# EAGLE board RedundantSensors (EAGLE 9.6.2), part 1 of 2
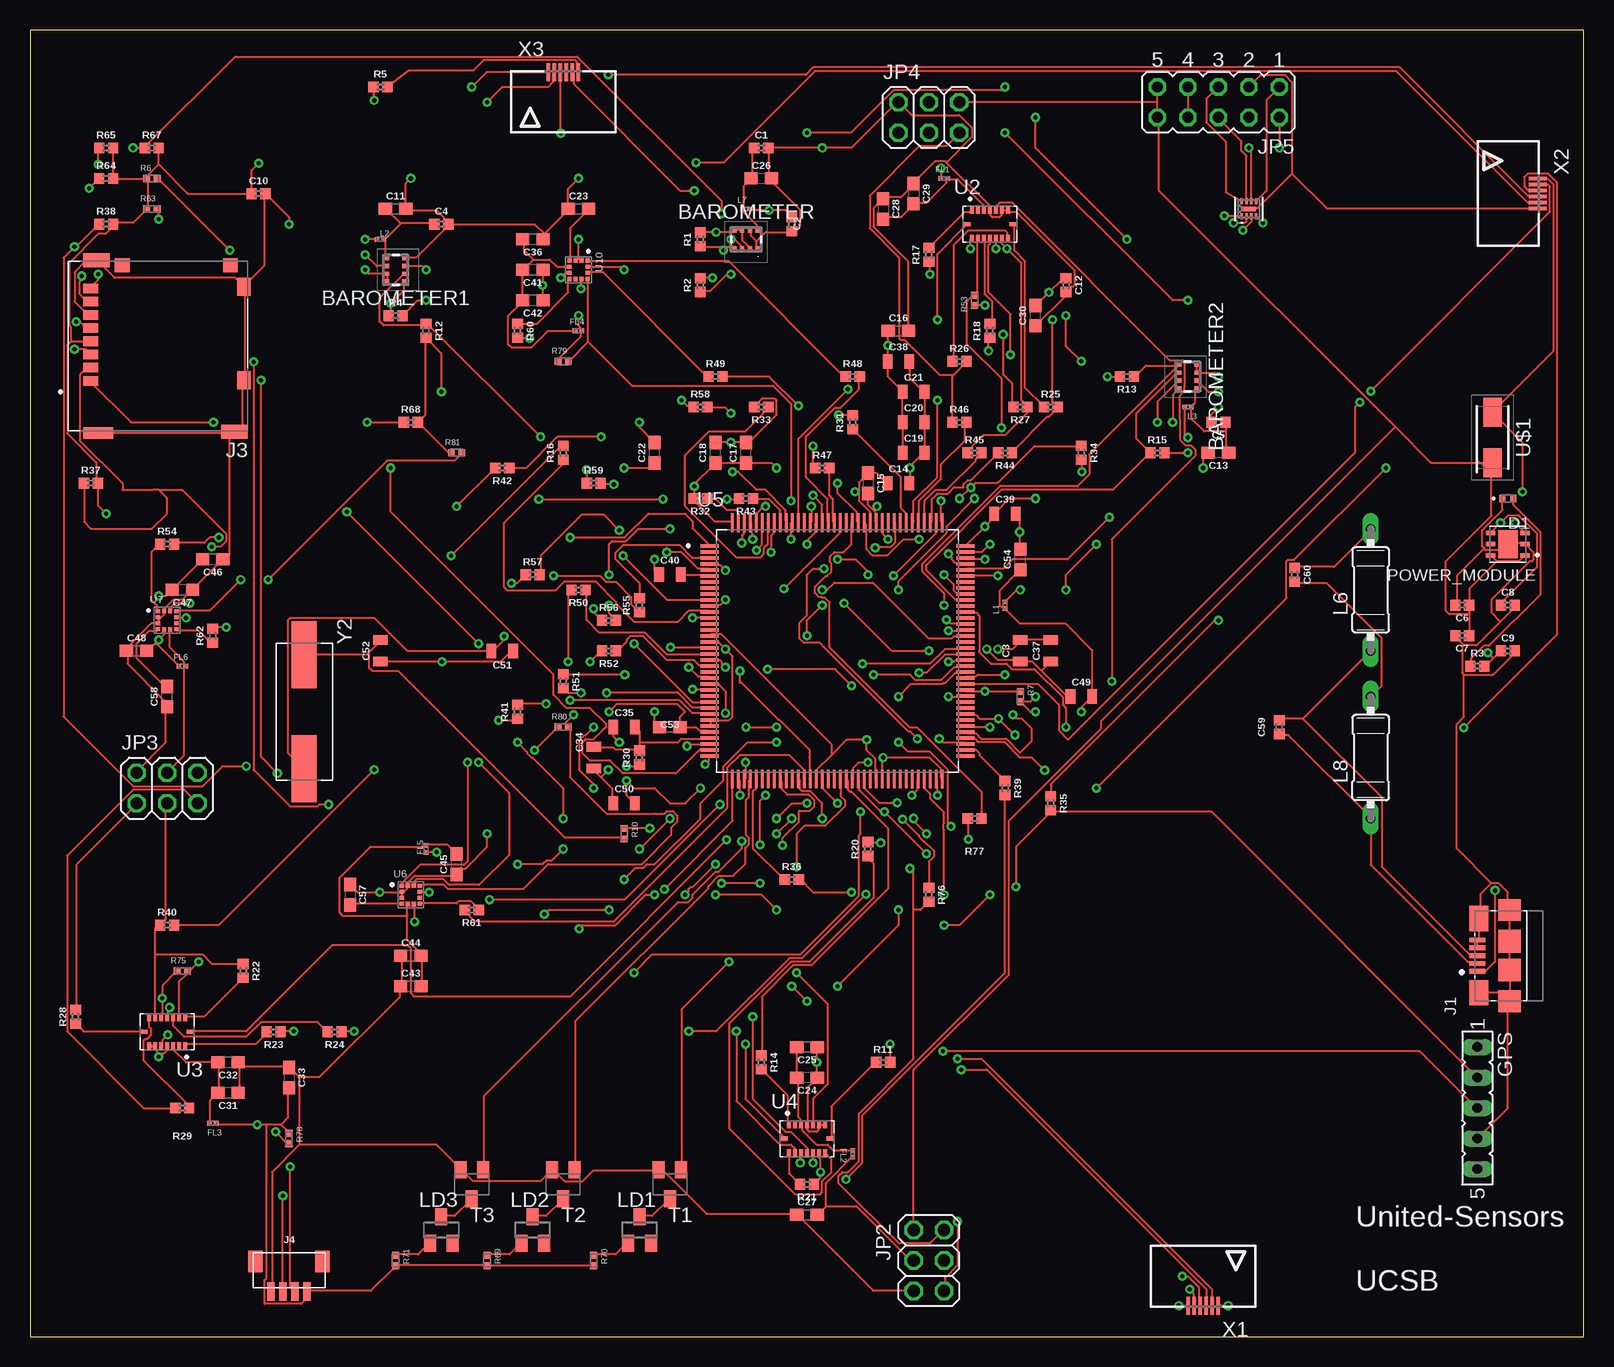
[diagram p2: board, top side]
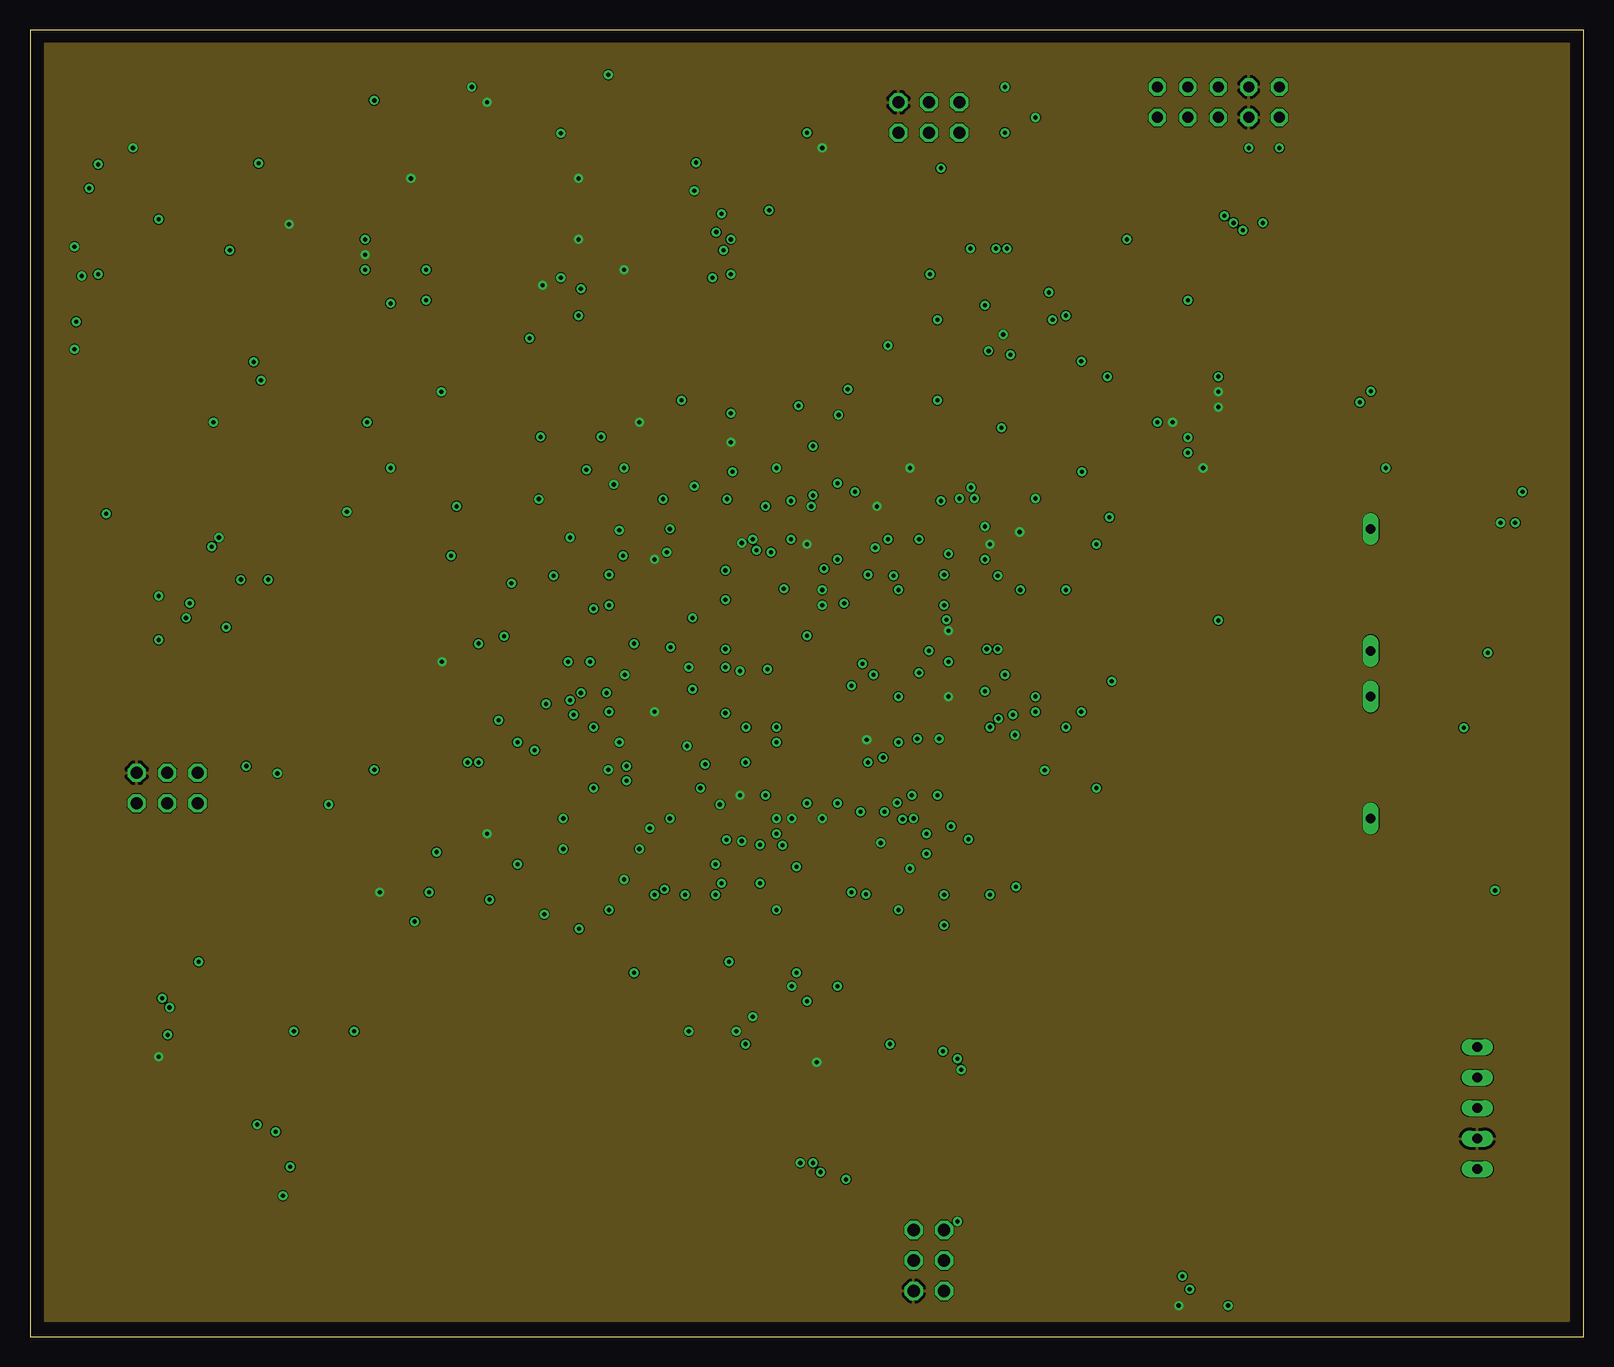
[diagram p3: board, inner layer Route2]
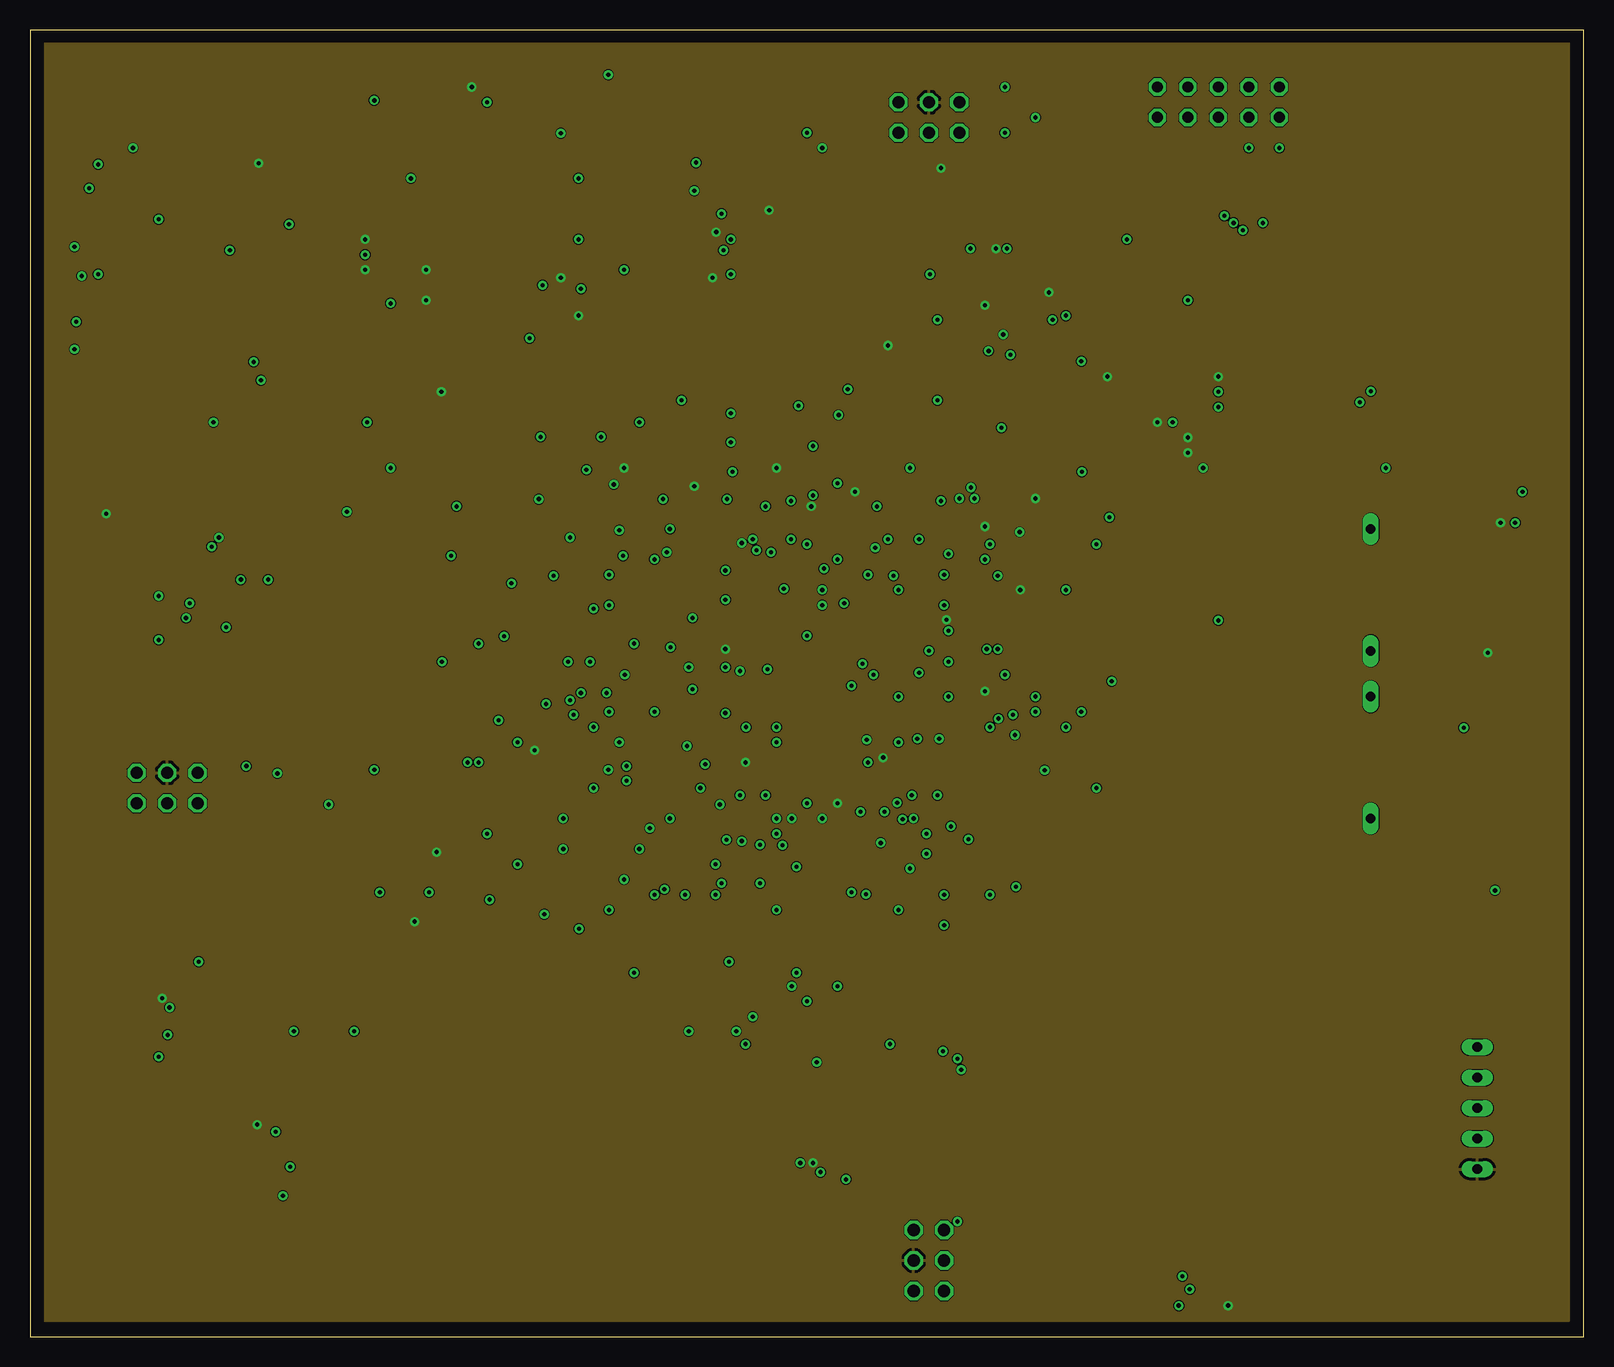
[diagram p4: board, inner layer Route15]
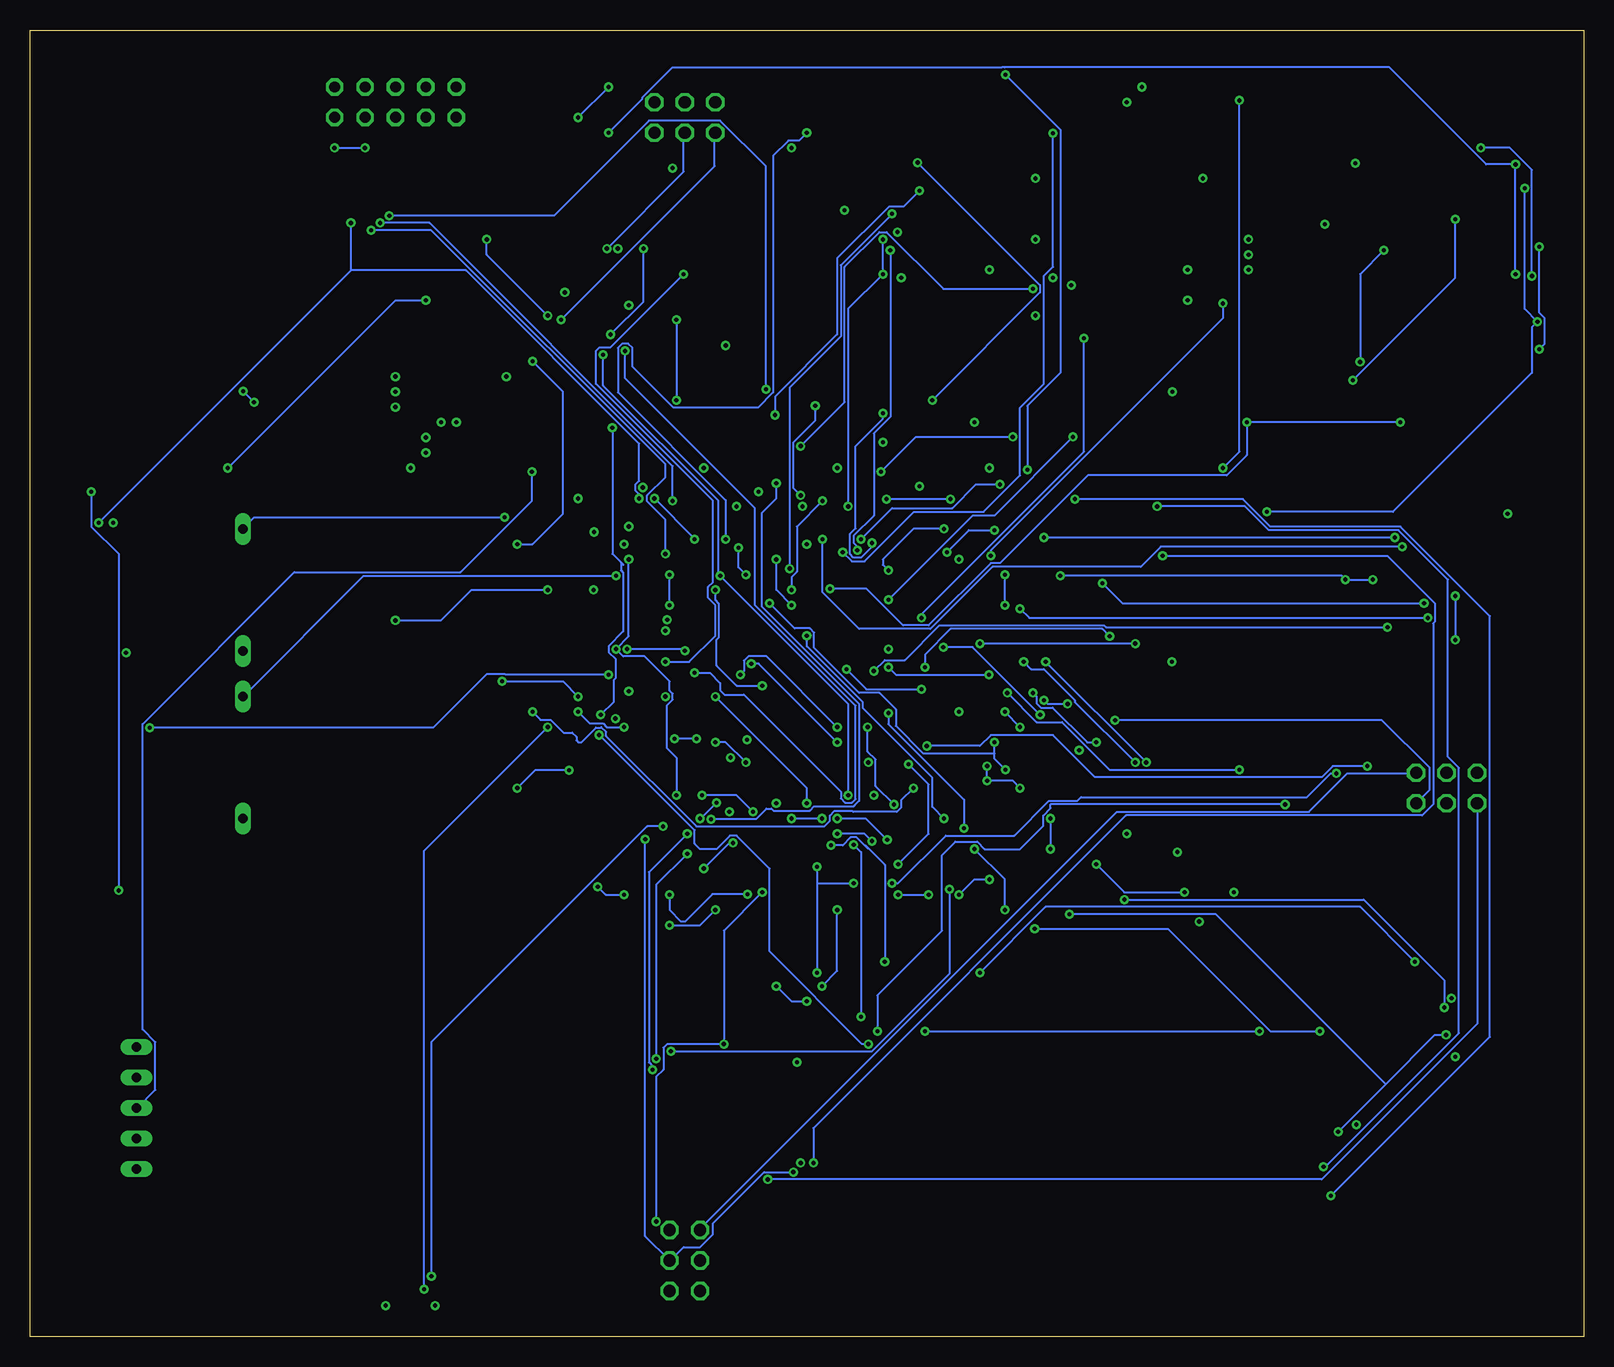
[diagram p5: board, bottom side, seen from below]

Size 129.52 x 108.89 mm. Coordinates in mm from the lower left corner, seen from the top.
Outline: 0,0 129.52,0 129.52,108.89 0,108.89 0,0
Copper layers (1+2*15+16): Top 0.035mm / dielectric 1.5mm / Route2 0.035mm / dielectric 0.15mm / Route15 0.035mm / dielectric 0.2mm / Bottom 0.035mm
Design rules "default *": minimum track width 6mil, minimum drill 0.35mm, track to track 3mil, track to pad 3mil, pad to pad 6mil, via to via 6mil, smd to smd 6mil, copper to edge 40mil, drill to drill 6mil, minimum pad ring 10mil, minimum via ring 8mil, stop-mask expansion 4mil, vias tented up to drill 0mil, thermal gap 10mil

## Footprints (pad centres in the part's own frame; a part is rotated, then mirrored left to right if it is on the bottom)
DPS310XTSA1 = smd 0.35 x 0.35: 1 0.975,-0.725; 2 0.325,-0.725; 3 -0.325,-0.725; 4 -0.975,-0.725; 5 -0.975,0.725; 6 -0.325,0.725; 7 0.325,0.725; 8 0.975,0.725
0402 = smd 0.85 x 0.9: 1 -0.58,0; 2 0.58,0
0805 = smd 0.8 x 1.2: 1 -0.9,0; 2 0.9,0
0603 = smd 1.1 x 1: 1 -0.85,0; 2 0.85,0
LED_SML-P11UTT86R = smd 0.5 x 0.6: A 0.45,0; C -0.45,0
BEADC0603X33N = smd 0.38 x 0.4: 1 -0.281,0; 2 0.281,0
FE05-1 = drill 0.813 long: 1 -5.08,0; 2 -2.54,0; 3 0,0; 4 2.54,0; 5 5.08,0
AMPHENOL_10118192-0001LF = smd 0.4 x 1.35: 1 -1.3,0; 2 -0.65,0; 3 0,0; 4 0.65,0; 5 1.3,0 | smd 2.1 x 1.6: SH1 -3.1,-0.125; SH2 3.1,-0.125 | smd 1.8 x 1.9: SH3 -3.8,-2.675; SH6 3.8,-2.675 | smd 1.9 x 1.9: SH4 -1.2,-2.675; SH5 1.2,-2.675
MOLEX_503182-1852 = smd 0.8 x 1.24: 1 -2.9,6.355; 2 -1.8,6.355; 3 -0.7,6.355; 4 0.4,6.355; 5 1.5,6.355; 6 2.6,6.355; 7 3.7,6.355; 8 4.8,6.355 | smd 1.16 x 1.2: DT 6.74,-5.275 | smd 0.95 x 2.5: P1 -7.245,5.725 | smd 1.15 x 2.2: P2 7.145,5.875; P3 -7.145,-5.605 | smd 1.5 x 1.15: P4 -2.84,-6.4; P5 4.94,-6.4 | smd 1.16 x 1.25: SW 6.74,3.725
BM04B-SRSS-TB = smd 0.6 x 1.55: 1 -1.5,-1.325; 2 -0.5,-1.325; 3 0.5,-1.325; 4 1.5,-1.325 | smd 1.2 x 1.8: M1 -2.8,1.2; M2 2.8,1.2
2X03 = drill 1.016 octagon: 1 -2.54,-1.27; 2 -2.54,1.27; 3 0,-1.27; 4 0,1.27; 5 2.54,-1.27; 6 2.54,1.27
JP5Q = drill 0.914 octagon: 1 -5.08,-1.27; 2 -5.08,1.27; 3 -2.54,-1.27; 4 -2.54,1.27; 5 0,-1.27; 6 0,1.27; 7 2.54,-1.27; 8 2.54,1.27; 9 5.08,-1.27; 10 5.08,1.27
MICC10 = drill 0.813 long: 1 -5.08,0; 2 5.08,0
SOT23 = smd 1 x 1.4: 1 -0.95,-1.1; 2 0.95,-1.1; 3 0,1.1
SON95P300X300X100-7N = smd 0.84 x 0.4: 1 -1.435,0.95; 2 -1.435,0; 3 -1.435,-0.95; 4 1.435,-0.95; 5 1.435,0; 6 1.435,0.95 | smd 1.625 x 2.365: 7 0,0
RESC1005X35N = smd 0.56 x 0.6: 1 -0.435,0; 2 0.435,0
SC59-BEC = smd 1 x 1.4: B -0.95,-1.2; C 0,1.2; E 0.95,-1.2
DQD8_1P2X0P4 = smd 0.5 x 0.2: 1 -0.625,0.6; 2 -0.625,0.2; 3 -0.625,-0.2; 4 -0.625,-0.6; 5 0.625,-0.6; 6 0.625,-0.2; 7 0.625,0.2; 8 0.625,0.6 | smd 0.4 x 1.2: 9 0,0
PQFN50P450X300X100-16N = smd 0.35 x 0.59: 1 -1.5,1.165; 2 -1,1.165; 3 -0.5,1.165; 4 0,1.165; 5 0.5,1.165; 6 1,1.165; 7 1.5,1.165; 9 1.5,-1.165; 10 1,-1.165; 11 0.5,-1.165; 12 0,-1.165; 13 -0.5,-1.165; 14 -1,-1.165; 15 -1.5,-1.165 | smd 0.59 x 0.35: 8 1.915,0; 16 -1.915,0
QFP50P2200X2200X160-144N = smd 1.56 x 0.28: 1 -10.68,8.75; 2 -10.68,8.25; 3 -10.68,7.75; 4 -10.68,7.25; 5 -10.68,6.75; 6 -10.68,6.25; 7 -10.68,5.75; 8 -10.68,5.25; 9 -10.68,4.75; 10 -10.68,4.25; 11 -10.68,3.75; 12 -10.68,3.25; 13 -10.68,2.75; 14 -10.68,2.25; 15 -10.68,1.75; 16 -10.68,1.25; 17 -10.68,0.75; 18 -10.68,0.25; 19 -10.68,-0.25; 20 -10.68,-0.75; 21 -10.68,-1.25; 22 -10.68,-1.75; 23 -10.68,-2.25; 24 -10.68,-2.75; 25 -10.68,-3.25; 26 -10.68,-3.75; 27 -10.68,-4.25; 28 -10.68,-4.75; 29 -10.68,-5.25; 30 -10.68,-5.75; 31 -10.68,-6.25; 32 -10.68,-6.75; 33 -10.68,-7.25; 34 -10.68,-7.75; 35 -10.68,-8.25; 36 -10.68,-8.75; 73 10.68,-8.75; 74 10.68,-8.25; 75 10.68,-7.75; 76 10.68,-7.25; 77 10.68,-6.75; 78 10.68,-6.25; 79 10.68,-5.75; 80 10.68,-5.25; 81 10.68,-4.75; 82 10.68,-4.25; 83 10.68,-3.75; 84 10.68,-3.25; 85 10.68,-2.75; 86 10.68,-2.25; 87 10.68,-1.75; 88 10.68,-1.25; 89 10.68,-0.75; 90 10.68,-0.25; 91 10.68,0.25; 92 10.68,0.75; 93 10.68,1.25; 94 10.68,1.75; 95 10.68,2.25; 96 10.68,2.75; 97 10.68,3.25; 98 10.68,3.75; 99 10.68,4.25; 100 10.68,4.75; 101 10.68,5.25; 102 10.68,5.75; 103 10.68,6.25; 104 10.68,6.75; 105 10.68,7.25; 106 10.68,7.75; 107 10.68,8.25; 108 10.68,8.75 | smd 0.28 x 1.56: 37 -8.75,-10.68; 38 -8.25,-10.68; 39 -7.75,-10.68; 40 -7.25,-10.68; 41 -6.75,-10.68; 42 -6.25,-10.68; 43 -5.75,-10.68; 44 -5.25,-10.68; 45 -4.75,-10.68; 46 -4.25,-10.68; 47 -3.75,-10.68; 48 -3.25,-10.68; 49 -2.75,-10.68; 50 -2.25,-10.68; 51 -1.75,-10.68; 52 -1.25,-10.68; 53 -0.75,-10.68; 54 -0.25,-10.68; 55 0.25,-10.68; 56 0.75,-10.68; 57 1.25,-10.68; 58 1.75,-10.68; 59 2.25,-10.68; 60 2.75,-10.68; 61 3.25,-10.68; 62 3.75,-10.68; 63 4.25,-10.68; 64 4.75,-10.68; 65 5.25,-10.68; 66 5.75,-10.68; 67 6.25,-10.68; 68 6.75,-10.68; 69 7.25,-10.68; 70 7.75,-10.68; 71 8.25,-10.68; 72 8.75,-10.68; 109 8.75,10.68; 110 8.25,10.68; 111 7.75,10.68; 112 7.25,10.68; 113 6.75,10.68; 114 6.25,10.68; 115 5.75,10.68; 116 5.25,10.68; 117 4.75,10.68; 118 4.25,10.68; 119 3.75,10.68; 120 3.25,10.68; 121 2.75,10.68; 122 2.25,10.68; 123 1.75,10.68; 124 1.25,10.68; 125 0.75,10.68; 126 0.25,10.68; 127 -0.25,10.68; 128 -0.75,10.68; 129 -1.25,10.68; 130 -1.75,10.68; 131 -2.25,10.68; 132 -2.75,10.68; 133 -3.25,10.68; 134 -3.75,10.68; 135 -4.25,10.68; 136 -4.75,10.68; 137 -5.25,10.68; 138 -5.75,10.68; 139 -6.25,10.68; 140 -6.75,10.68; 141 -7.25,10.68; 142 -7.75,10.68; 143 -8.25,10.68; 144 -8.75,10.68
XDCR_LIS3MDLTR = smd 0.375 x 0.35: 1 -0.762,0.75; 2 -0.762,0.25; 3 -0.762,-0.25; 4 -0.762,-0.75; 7 0.762,-0.75; 8 0.762,-0.25; 9 0.762,0.25; 10 0.762,0.75 | smd 0.35 x 0.375: 5 -0.25,-0.762; 6 0.25,-0.762; 11 0.25,0.762; 12 -0.25,0.762
DIOM5226X223N = smd 2.4 x 1.55: 1 -2.1,0; 2 2.1,0
6FLZ-SM = smd 0.3 x 1.5: 1 -1.25,2.5; 2 -0.75,2.5; 3 -0.25,2.5; 4 0.25,2.5; 5 0.75,2.5; 6 1.25,2.5
XTAL_ABLS-8.000MHZ-B2-T = smd 5.6 x 2.1: 1 -4.75,0; 2 4.75,0

## Placement (x,y rotation side)
BAROMETER  DPS310XTSA1  [DPS310XTSA1]  59.69,91.44 0 top
BAROMETER1  DPS310XTSA1  [DPS310XTSA1]  30.48,88.9 90 top
BAROMETER2  DPS310XTSA1  [DPS310XTSA1]  96.52,80.01 270 top
C1  0.1uF  [0402]  60.96,99.06 0 top
C2  0.1uF  [0402]  63.5,92.71 270 top
C3  2.2uF  [0805]  82.55,57.15 90 top
C4  0.1uF  [0402]  34.29,92.71 0 top
C5  0.1uF  [0402]  99.06,76.2 180 top
C6  0.1uF  [0402]  119.38,60.96 180 top
C7  1.0uF  [0402]  119.38,58.42 180 top
C8  0.1uF  [0402]  123.19,60.96 0 top
C9  1.0uF  [0402]  123.19,57.15 0 top
C10  0.1uF  [0402]  19.05,95.25 0 top
C11  4.7uF  [0603]  30.48,93.98 0 top
C12  0.1uF  [0402]  86.36,87.63 270 top
C13  4.7uF  [0603]  99.06,73.66 180 top
C14  1.0uF  [0805]  72.39,71.12 0 top
C15  0.1uF  [0603]  69.85,71.12 270 top
C16  0.1uF  [0603]  72.39,83.82 0 top
C17  0.1uF  [0603]  59.69,73.66 90 top
C18  0.1uF  [0603]  57.15,73.66 90 top
C19  1.0uF  [0805]  73.66,73.66 0 top
C20  1.0uF  [0805]  73.66,76.2 0 top
C21  1.0uF  [0805]  73.66,78.74 0 top
C22  4.7uF  [0603]  52.07,73.66 90 top
C23  0.1uF  [0603]  45.72,93.98 0 top
C24  0.1uF  [0603]  64.77,21.59 180 top
C25  0.1uF  [0603]  64.77,24.13 180 top
C26  4.7uF  [0603]  60.96,96.52 0 top
C27  0.1uF  [0603]  64.77,10.16 0 top
C28  0.1uF  [0603]  71.12,93.98 270 top
C29  0.1uF  [0603]  73.66,95.25 270 top
C30  0.1uF  [0603]  83.82,85.09 90 top
C31  0.1uF  [0603]  16.51,20.32 180 top
C32  0.1uF  [0603]  16.51,22.86 180 top
C33  0.1uF  [0603]  21.59,21.59 270 top
C34  1.0uF  [0805]  46.99,48.26 90 top
C35  0.1uf  [0805]  49.53,50.8 0 top
C36  0.1uF  [0603]  41.91,91.44 180 top
C37  2.2uf  [0805]  85.09,57.15 90 top
C38  1.0uF  [0805]  72.39,81.28 0 top
C39  1.0uF  [0805]  81.28,68.58 0 top
C40  1.0uF  [0805]  53.34,63.5 0 top
C41  0.1uF  [0603]  41.91,88.9 180 top
C42  0.1uF  [0603]  41.91,86.36 180 top
C43  0.1uF  [0603]  31.75,29.21 0 top
C44  0.1uF  [0603]  31.75,31.75 0 top
C45  0.1uF  [0603]  35.56,39.37 90 top
C46  0.1uF  [0603]  15.24,64.77 180 top
C47  0.1uF  [0603]  12.7,62.23 180 top
C48  0.1uF  [0603]  8.89,57.15 0 top
C49  1.0uF  [0805]  87.63,53.34 0 top
C50  0.1uf  [0805]  49.53,44.45 0 top
C51  5.6pF  [0805]  39.37,57.15 180 top
C52  5.6pF  [0805]  29.21,57.15 90 top
C53  0.1uF  [0603]  53.34,50.8 180 top
C54  4.7uF  [0603]  82.55,64.77 90 top
C57  0.1uF  [0603]  26.67,36.83 270 top
C58  0.1uF  [0603]  11.43,53.34 90 top
C59  1.0uF  [0402]  104.14,50.8 270 top
C60  1.0uF  [0402]  105.41,63.5 270 top
D1  SML-P12VTT86  [LED_SML-P11UTT86R]  123.19,69.85 0 top
FL1  BLM03AG601SN1D  [BEADC0603X33N]  76.2,96.52 0 top
FL2  BLM03AG601SN1D  [BEADC0603X33N]  68.58,15.24 90 top
FL3  BLM03AG601SN1D  [BEADC0603X33N]  15.24,17.78 180 top
FL4  BLM03AG601SN1D  [BEADC0603X33N]  45.72,83.82 0 top
FL5  BLM03AG601SN1D  [BEADC0603X33N]  33.02,40.64 270 top
FL6  BLM03AG601SN1D  [BEADC0603X33N]  12.7,55.88 0 top
GPS  [FE05-1]  120.65,19.05 270 top
J1  10118192-0001LF  [AMPHENOL_10118192-0001LF]  120.65,31.75 90 top
J3  503182-1852  [MOLEX_503182-1852]  11.43,82.55 90 top
J4  JST-SH-4_SMT_V  [BM04B-SRSS-TB]  21.59,5.08 0 top
JP2  [2X03]  74.93,6.35 90 top
JP3  [2X03]  11.43,45.72 0 top
JP4  [2X03]  74.93,101.6 0 top
JP5  [JP5Q]  99.06,102.87 180 top
L1  BLM03AG601SN1D  [BEADC0603X33N]  81.28,60.96 90 top
L2  BLM03AG601SN1D  [BEADC0603X33N]  29.21,91.44 180 top
L3  BLM03AG601SN1D  [BEADC0603X33N]  96.52,77.47 180 top
L6  150uH  [MICC10]  111.76,62.23 90 top
L7  BLM03AG601SN1D  [BEADC0603X33N]  59.69,93.98 0 top
L8  150uH  [MICC10]  111.76,48.26 90 top
LD1  PL006-WCR12  [SOT23]  50.8,8.89 0 top
LD2  PL006-WCG13  [SOT23]  41.91,8.89 0 top
LD3  PL006-WCY01  [SOT23]  34.29,8.89 0 top
POWER_MODULE  LD39050PU33R  [SON95P300X300X100-7N]  123.19,66.04 180 top
R1  10k  [0402]  55.88,91.44 90 top
R2  10k  [0402]  55.88,87.63 90 top
R3  1KOHM-0402-1/16W-1%  [0402]  120.65,55.88 0 top
R4  10k  [0402]  30.48,85.09 0 top
R5  22  [0402]  29.21,104.14 0 top
R6  10K  [RESC1005X35N]  10.16,96.52 0 top
R7  10K  [RESC1005X35N]  82.55,53.34 270 top
R10  220  [RESC1005X35N]  49.53,41.91 270 top
R11  0  [0402]  71.12,22.86 0 top
R12  10k  [0402]  33.02,83.82 270 top
R13  10k  [0402]  91.44,80.01 180 top
R14  22  [0402]  60.96,22.86 270 top
R15  10k  [0402]  93.98,73.66 0 top
R16  22  [0402]  44.45,73.66 90 top
R17  22  [0402]  74.93,90.17 90 top
R18  22  [0402]  80.01,83.82 90 top
R20  0  [0402]  69.85,40.64 90 top
R21  0  [0402]  64.77,12.7 180 top
R22  0  [0402]  17.78,30.48 270 top
R23  22  [0402]  20.32,25.4 180 top
R24  22  [0402]  25.4,25.4 180 top
R25  0  [0402]  85.09,77.47 0 top
R26  0  [0402]  77.47,81.28 0 top
R27  0  [0402]  82.55,77.47 180 top
R28  0  [0402]  3.81,26.67 90 top
R29  0  [0402]  12.7,19.05 180 top
R30  10k  [0402]  50.8,48.26 90 top
R31  22  [0402]  68.58,76.2 90 top
R32  1000  [0402]  55.88,69.85 180 top
R33  1000  [0402]  60.96,77.47 180 top
R34  22  [0402]  87.63,73.66 270 top
R35  22  [0402]  85.09,44.45 270 top
R36  22  [0402]  63.5,38.1 0 top
R37  47k  [0402]  5.08,71.12 0 top
R38  47k  [0402]  6.35,92.71 0 top
R39  22  [0402]  81.28,45.72 270 top
R40  22  [0402]  11.43,34.29 0 top
R41  22  [0402]  40.64,52.07 90 top
R42  22  [0402]  39.37,72.39 180 top
R43  22  [0402]  59.69,69.85 180 top
R44  22  [0402]  81.28,73.66 180 top
R45  22  [0402]  78.74,73.66 0 top
R46  22  [0402]  77.47,76.2 0 top
R47  22  [0402]  66.04,72.39 0 top
R48  22  [0402]  68.58,80.01 0 top
R49  22  [0402]  57.15,80.01 0 top
R50  22  [0402]  45.72,62.23 180 top
R51  22  [0402]  44.45,54.61 270 top
R52  22  [0402]  48.26,57.15 180 top
R53  10K  [RESC1005X35N]  78.74,86.36 90 top
R54  22  [0402]  11.43,66.04 0 top
R55  22  [0402]  50.8,60.96 90 top
R56  22  [0402]  48.26,59.69 0 top
R57  22  [0402]  41.91,63.5 0 top
R58  22  [0402]  55.88,77.47 0 top
R59  22  [0402]  46.99,71.12 0 top
R60  22  [0402]  40.64,83.82 270 top
R61  22  [0402]  36.83,35.56 180 top
R62  22  [0402]  15.24,58.42 90 top
R63  10K  [RESC1005X35N]  10.16,93.98 0 top
R64  47k  [0402]  6.35,96.52 0 top
R65  47k  [0402]  6.35,99.06 0 top
R67  47k  [0402]  10.16,99.06 0 top
R68  47k  [0402]  31.75,76.2 0 top
R69  270  [RESC1005X35N]  38.1,6.35 270 top
R70  270  [RESC1005X35N]  46.99,6.35 270 top
R71  270  [RESC1005X35N]  30.48,6.35 270 top
R75  10K  [RESC1005X35N]  12.7,30.48 0 top
R76  22  [0402]  74.93,36.83 270 top
R77  22  [0402]  78.74,43.18 0 top
R78  10K  [RESC1005X35N]  21.59,16.51 270 top
R79  10K  [RESC1005X35N]  44.45,81.28 0 top
R80  10K  [RESC1005X35N]  44.45,50.8 0 top
R81  10K  [RESC1005X35N]  35.56,73.66 0 top
T1  [SC59-BEC]  53.34,12.7 180 top
T2  [SC59-BEC]  44.45,12.7 180 top
T3  [SC59-BEC]  36.83,12.7 180 top
U1  TPD4F003DQDR  [DQD8_1P2X0P4]  101.6,93.98 90 top
U2  BMI088  [PQFN50P450X300X100-16N]  80.01,92.71 0 top
U3  BMI088  [PQFN50P450X300X100-16N]  11.43,25.4 180 top
U4  BMI088  [PQFN50P450X300X100-16N]  64.77,16.51 0 top
U5  STM32H743ZIT6  [QFP50P2200X2200X160-144N]  67.31,57.15 0 top
U6  LIS3MDLTR  [XDCR_LIS3MDLTR]  31.75,36.83 0 top
U7  LIS3MDLTR  [XDCR_LIS3MDLTR]  11.43,59.69 0 top
U10  LIS3MDLTR  [XDCR_LIS3MDLTR]  45.72,88.9 270 top
U$1  STPS1L30A  [DIOM5226X223N]  121.92,74.93 90 top
X1  LiDAR  [6FLZ-SM]  97.79,5.08 180 top
X2  Telemetry  [6FLZ-SM]  123.19,95.25 270 top
X3  RC  [6FLZ-SM]  44.45,102.87 0 top
Y2  8MHz  [XTAL_ABLS-8.000MHZ-B2-T]  22.86,52.07 270 top